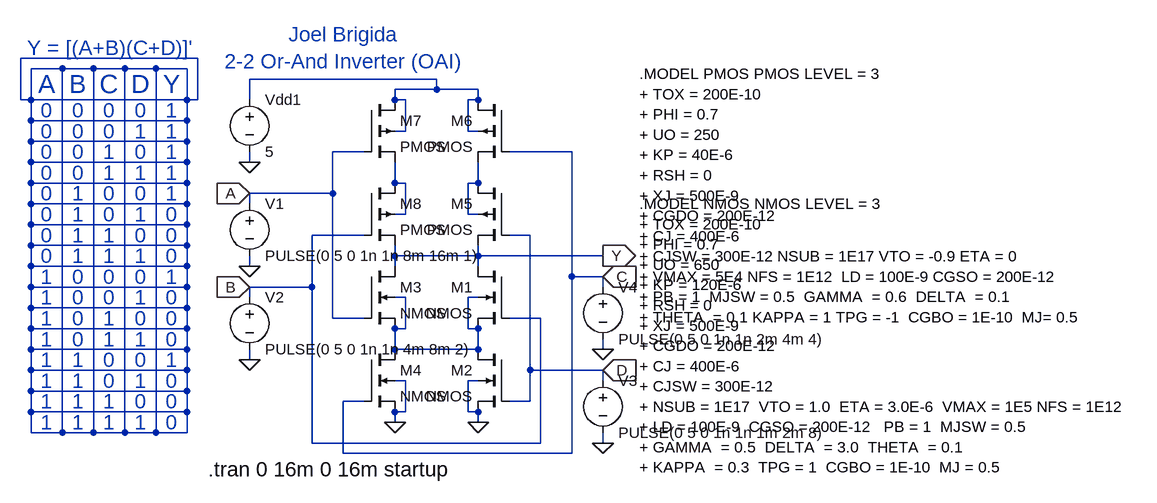
[diagram p0: schematic OAI2-2.asc]
OAI2-2.asc, the LTspice schematic file:
Version 4
SHEET 1 908 680
WIRE -176 -272 -448 -272
WIRE -384 -256 -432 -256
WIRE -336 -256 -384 -256
WIRE -288 -256 -336 -256
WIRE -240 -256 -288 -256
WIRE -192 -256 -240 -256
WIRE 192 -240 -96 -240
WIRE 192 -224 192 -240
WIRE 192 -224 128 -224
WIRE 256 -224 192 -224
WIRE -448 -208 -448 -272
WIRE -432 -208 -432 -256
WIRE -432 -208 -448 -208
WIRE -192 -208 -192 -256
WIRE -192 -208 -432 -208
WIRE -176 -208 -176 -272
WIRE -176 -208 -192 -208
WIRE -96 -208 -96 -240
WIRE 128 -208 128 -224
WIRE 144 -208 128 -208
WIRE 256 -208 256 -224
WIRE 256 -208 240 -208
WIRE -432 -176 -432 -208
WIRE -192 -176 -192 -208
WIRE -192 -176 -432 -176
WIRE 144 -160 144 -208
WIRE 144 -160 128 -160
WIRE 240 -160 240 -208
WIRE 256 -160 240 -160
WIRE -432 -144 -432 -176
WIRE -192 -144 -192 -176
WIRE -192 -144 -432 -144
WIRE 80 -128 32 -128
WIRE 400 -128 304 -128
WIRE -432 -112 -432 -144
WIRE -192 -112 -192 -144
WIRE -192 -112 -432 -112
WIRE -96 -112 -96 -128
WIRE -432 -80 -432 -112
WIRE -192 -80 -192 -112
WIRE -192 -80 -432 -80
WIRE 128 -80 128 -112
WIRE 144 -80 128 -80
WIRE 256 -80 256 -112
WIRE 256 -80 240 -80
WIRE 32 -64 32 -128
WIRE 32 -64 -96 -64
WIRE -432 -48 -432 -80
WIRE -192 -48 -192 -80
WIRE -192 -48 -432 -48
WIRE -96 -48 -96 -64
WIRE 144 -32 144 -80
WIRE 144 -32 128 -32
WIRE 240 -32 240 -80
WIRE 256 -32 240 -32
WIRE -432 -16 -432 -48
WIRE -192 -16 -192 -48
WIRE -192 -16 -432 -16
WIRE 80 0 0 0
WIRE 336 0 304 0
WIRE -432 16 -432 -16
WIRE -192 16 -192 -16
WIRE -192 16 -432 16
WIRE 128 32 128 16
WIRE 256 32 256 16
WIRE 256 32 128 32
WIRE 448 32 256 32
WIRE -432 48 -432 16
WIRE -192 48 -192 16
WIRE -192 48 -432 48
WIRE -96 48 -96 32
WIRE 128 48 128 32
WIRE 256 48 256 32
WIRE 400 64 400 -128
WIRE 448 64 400 64
WIRE -432 80 -432 48
WIRE -192 80 -192 48
WIRE -192 80 -432 80
WIRE 0 80 0 0
WIRE 0 80 -96 80
WIRE 448 80 448 64
WIRE -96 96 -96 80
WIRE 144 96 128 96
WIRE 256 96 240 96
WIRE -432 112 -432 80
WIRE -192 112 -192 80
WIRE -192 112 -432 112
WIRE 32 128 32 -64
WIRE 80 128 32 128
WIRE 352 128 304 128
WIRE -432 144 -432 112
WIRE -192 144 -192 112
WIRE -192 144 -432 144
WIRE 144 144 144 96
WIRE 144 144 128 144
WIRE 240 144 240 96
WIRE 256 144 240 144
WIRE -432 176 -432 144
WIRE -192 176 -192 144
WIRE -192 176 -432 176
WIRE 128 176 128 144
WIRE 256 176 256 144
WIRE 256 176 128 176
WIRE 448 176 448 160
WIRE -96 192 -96 176
WIRE -432 208 -432 176
WIRE -192 208 -192 176
WIRE -192 208 -432 208
WIRE 336 208 336 0
WIRE 448 208 336 208
WIRE 144 224 128 224
WIRE 256 224 240 224
WIRE 448 224 448 208
WIRE -432 240 -432 208
WIRE -192 240 -192 208
WIRE -192 240 -432 240
WIRE 80 256 48 256
WIRE 336 256 336 208
WIRE 336 256 304 256
WIRE -432 272 -432 240
WIRE -192 272 -192 240
WIRE -192 272 -432 272
WIRE 144 272 144 224
WIRE 144 272 128 272
WIRE 240 272 240 224
WIRE 256 272 240 272
WIRE 128 288 128 272
WIRE 256 288 256 272
WIRE -432 304 -432 272
WIRE -384 304 -384 -256
WIRE -384 304 -432 304
WIRE -336 304 -336 -256
WIRE -336 304 -384 304
WIRE -288 304 -288 -256
WIRE -288 304 -336 304
WIRE -240 304 -240 -256
WIRE -240 304 -288 304
WIRE -192 304 -192 272
WIRE -192 304 -240 304
WIRE 0 320 0 80
WIRE 352 320 352 128
WIRE 352 320 0 320
WIRE 448 320 448 304
WIRE 48 336 48 256
WIRE 400 336 400 64
WIRE 400 336 48 336
FLAG 128 288 0
FLAG 256 288 0
FLAG -96 -112 0
FLAG 448 32 Y
IOPIN 448 32 Out
FLAG -96 -64 A
IOPIN -96 -64 In
FLAG -96 48 0
FLAG -96 192 0
FLAG -96 80 B
IOPIN -96 80 In
FLAG 448 176 0
FLAG 448 320 0
FLAG 448 64 C
IOPIN 448 64 In
FLAG 448 208 D
IOPIN 448 208 In
SYMBOL nmos4 304 48 M0
SYMATTR InstName M1
SYMBOL nmos4 304 176 M0
SYMATTR InstName M2
SYMBOL nmos4 80 48 R0
SYMATTR InstName M3
SYMBOL nmos4 80 176 R0
SYMATTR InstName M4
SYMBOL pmos4 304 -80 M0
SYMATTR InstName M5
SYMBOL pmos4 304 -208 M0
SYMATTR InstName M6
SYMBOL pmos4 80 -208 R0
SYMATTR InstName M7
SYMBOL pmos4 80 -80 R0
SYMATTR InstName M8
SYMBOL voltage -96 -224 R0
SYMATTR InstName Vdd1
SYMATTR Value 5
SYMBOL voltage -96 -64 R0
WINDOW 123 0 0 Left 0
WINDOW 39 0 0 Left 0
SYMATTR InstName V1
SYMATTR Value PULSE(0 5 0 1n 1n 8m 16m 1)
SYMBOL voltage -96 80 R0
WINDOW 123 0 0 Left 0
WINDOW 39 0 0 Left 0
SYMATTR InstName V2
SYMATTR Value PULSE(0 5 0 1n 1n 4m 8m 2)
SYMBOL voltage 448 208 R0
WINDOW 123 0 0 Left 0
WINDOW 39 0 0 Left 0
SYMATTR InstName V3
SYMATTR Value PULSE(0 5 0 1n 1n 1m 2m 8)
SYMBOL voltage 448 64 R0
WINDOW 123 0 0 Left 0
WINDOW 39 0 0 Left 0
SYMATTR InstName V4
SYMATTR Value PULSE(0 5 0 1n 1n 2m 4m 4)
TEXT 48 -288 Center 3 ;Joel Brigida\n2-2 Or-And Inverter (OAI)
TEXT 504 -248 Left 2 !.MODEL PMOS PMOS LEVEL = 3\n+ TOX = 200E-10\n+ PHI = 0.7\n+ UO = 250 \n+ KP = 40E-6\n+ RSH = 0\n+ XJ = 500E-9 \n+ CGDO = 200E-12 \n+ CJ = 400E-6\n+ CJSW = 300E-12 NSUB = 1E17 VTO = -0.9 ETA = 0\n+ VMAX = 5E4 NFS = 1E12  LD = 100E-9 CGSO = 200E-12\n+ PB = 1  MJSW = 0.5  GAMMA  = 0.6  DELTA  = 0.1\n+ THETA  = 0.1 KAPPA = 1 TPG = -1  CGBO = 1E-10  MJ= 0.5
TEXT 504 -48 Left 2 !.MODEL NMOS NMOS LEVEL = 3\n+ TOX = 200E-10\n+ PHI = 0.7\n+ UO = 650\n+ KP = 120E-6\n+ RSH = 0\n+ XJ = 500E-9\n+ CGDO = 200E-12\n+ CJ = 400E-6\n+ CJSW = 300E-12\n+ NSUB = 1E17  VTO = 1.0  ETA = 3.0E-6  VMAX = 1E5 NFS = 1E12   \n+ LD = 100E-9  CGSO = 200E-12   PB = 1  MJSW = 0.5\n+ GAMMA  = 0.5  DELTA  = 3.0  THETA  = 0.1\n+ KAPPA  = 0.3  TPG = 1  CGBO = 1E-10  MJ = 0.5
TEXT -160 360 Left 3 !.tran 0 16m 0 16m startup
TEXT -312 -288 Center 3 ;Y = [(A+B)(C+D)]'
TEXT -408 -232 Center 4 ;A
TEXT -360 -232 Center 4 ;B
TEXT -312 -232 Center 4 ;C
TEXT -264 -232 Center 4 ;D
TEXT -216 -232 Center 4 ;Y
TEXT -408 -160 Center 3 ;0
TEXT -408 -128 Center 3 ;0
TEXT -408 -96 Center 3 ;0
TEXT -408 -64 Center 3 ;0
TEXT -408 -32 Center 3 ;0
TEXT -408 0 Center 3 ;0
TEXT -408 32 Center 3 ;0
TEXT -360 -160 Center 3 ;0
TEXT -360 -128 Center 3 ;0
TEXT -360 -96 Center 3 ;0
TEXT -360 64 Center 3 ;0
TEXT -360 96 Center 3 ;0
TEXT -360 128 Center 3 ;0
TEXT -360 160 Center 3 ;0
TEXT -312 -160 Center 3 ;0
TEXT -312 -64 Center 3 ;0
TEXT -312 -32 Center 3 ;0
TEXT -312 32 Center 3 ;1
TEXT -312 64 Center 3 ;0
TEXT -312 192 Center 3 ;0
TEXT -312 224 Center 3 ;0
TEXT -312 96 Center 3 ;0
TEXT -312 0 Center 3 ;1
TEXT -312 -96 Center 3 ;1
TEXT -312 -128 Center 3 ;1
TEXT -312 160 Center 3 ;1
TEXT -312 128 Center 3 ;1
TEXT -312 288 Center 3 ;1
TEXT -312 256 Center 3 ;1
TEXT -360 -32 Center 3 ;1
TEXT -360 -64 Center 3 ;1
TEXT -360 32 Center 3 ;1
TEXT -360 0 Center 3 ;1
TEXT -360 224 Center 3 ;1
TEXT -360 192 Center 3 ;1
TEXT -360 288 Center 3 ;1
TEXT -360 256 Center 3 ;1
TEXT -408 96 Center 3 ;1
TEXT -408 64 Center 3 ;1
TEXT -408 160 Center 3 ;1
TEXT -408 128 Center 3 ;1
TEXT -408 192 Center 3 ;1
TEXT -408 256 Center 3 ;1
TEXT -408 224 Center 3 ;1
TEXT -408 288 Center 3 ;1
TEXT -264 -160 Center 3 ;1
TEXT -264 -96 Center 3 ;1
TEXT -264 -32 Center 3 ;1
TEXT -264 32 Center 3 ;1
TEXT -264 96 Center 3 ;1
TEXT -264 160 Center 3 ;1
TEXT -264 224 Center 3 ;1
TEXT -264 288 Center 3 ;1
TEXT -264 -128 Center 3 ;0
TEXT -264 -64 Center 3 ;0
TEXT -264 0 Center 3 ;0
TEXT -264 64 Center 3 ;0
TEXT -264 128 Center 3 ;0
TEXT -264 192 Center 3 ;0
TEXT -264 256 Center 3 ;0
TEXT -216 -192 Center 3 ;1
TEXT -216 96 Center 3 ;0
TEXT -216 -160 Center 3 ;1
TEXT -216 -128 Center 3 ;1
TEXT -216 -96 Center 3 ;1
TEXT -216 -64 Center 3 ;1
TEXT -216 -32 Center 3 ;0
TEXT -216 0 Center 3 ;0
TEXT -216 32 Center 3 ;0
TEXT -216 64 Center 3 ;1
TEXT -216 192 Center 3 ;1
TEXT -216 128 Center 3 ;0
TEXT -216 160 Center 3 ;0
TEXT -216 224 Center 3 ;0
TEXT -216 256 Center 3 ;0
TEXT -216 288 Center 3 ;0
TEXT -408 -192 Center 3 ;0
TEXT -360 -192 Center 3 ;0
TEXT -312 -192 Center 3 ;0
TEXT -264 -192 Center 3 ;0

The netlist it stands for:
* OAI2-2.asc
M1 Y B N005 N005 NMOS
M2 N005 D 0 0 NMOS
M3 Y A N005 N005 NMOS
M4 N005 C 0 0 NMOS
M5 N004 D Y N004 PMOS
M6 N002 C N004 N002 PMOS
M7 N002 A N003 N002 PMOS
M8 N003 B Y N003 PMOS
Vdd1 N002 0 5
V1 A 0 PULSE(0 5 0 1n 1n 8m 16m 1)
V2 B 0 PULSE(0 5 0 1n 1n 4m 8m 2)
V3 D 0 PULSE(0 5 0 1n 1n 1m 2m 8)
V4 C 0 PULSE(0 5 0 1n 1n 2m 4m 4)
.model NMOS NMOS
.model PMOS PMOS
.lib standard.mos
* Joel Brigida
* 2-2 Or-And Inverter (OAI)
.MODEL PMOS PMOS LEVEL = 3
+ TOX = 200E-10
+ PHI = 0.7
+ UO = 250
+ KP = 40E-6
+ RSH = 0
+ XJ = 500E-9
+ CGDO = 200E-12
+ CJ = 400E-6
+ CJSW = 300E-12 NSUB = 1E17 VTO = -0.9 ETA = 0
+ VMAX = 5E4 NFS = 1E12  LD = 100E-9 CGSO = 200E-12
+ PB = 1  MJSW = 0.5  GAMMA  = 0.6  DELTA  = 0.1
+ THETA  = 0.1 KAPPA = 1 TPG = -1  CGBO = 1E-10  MJ= 0.5
.MODEL NMOS NMOS LEVEL = 3
+ TOX = 200E-10
+ PHI = 0.7
+ UO = 650
+ KP = 120E-6
+ RSH = 0
+ XJ = 500E-9
+ CGDO = 200E-12
+ CJ = 400E-6
+ CJSW = 300E-12
+ NSUB = 1E17  VTO = 1.0  ETA = 3.0E-6  VMAX = 1E5 NFS = 1E12
+ LD = 100E-9  CGSO = 200E-12   PB = 1  MJSW = 0.5
+ GAMMA  = 0.5  DELTA  = 3.0  THETA  = 0.1
+ KAPPA  = 0.3  TPG = 1  CGBO = 1E-10  MJ = 0.5
.tran 0 16m 0 16m startup
* Y = [(A+B)(C+D)]'
* A
* B
* C
* D
* Y
* 0
* 0
* 0
* 0
* 0
* 0
* 0
* 0
* 0
* 0
* 0
* 0
* 0
* 0
* 0
* 0
* 0
* 1
* 0
* 0
* 0
* 0
* 1
* 1
* 1
* 1
* 1
* 1
* 1
* 1
* 1
* 1
* 1
* 1
* 1
* 1
* 1
* 1
* 1
* 1
* 1
* 1
* 1
* 1
* 1
* 1
* 1
* 1
* 1
* 1
* 1
* 1
* 1
* 0
* 0
* 0
* 0
* 0
* 0
* 0
* 1
* 0
* 1
* 1
* 1
* 1
* 0
* 0
* 0
* 1
* 1
* 0
* 0
* 0
* 0
* 0
* 0
* 0
* 0
* 0
.backanno
.end